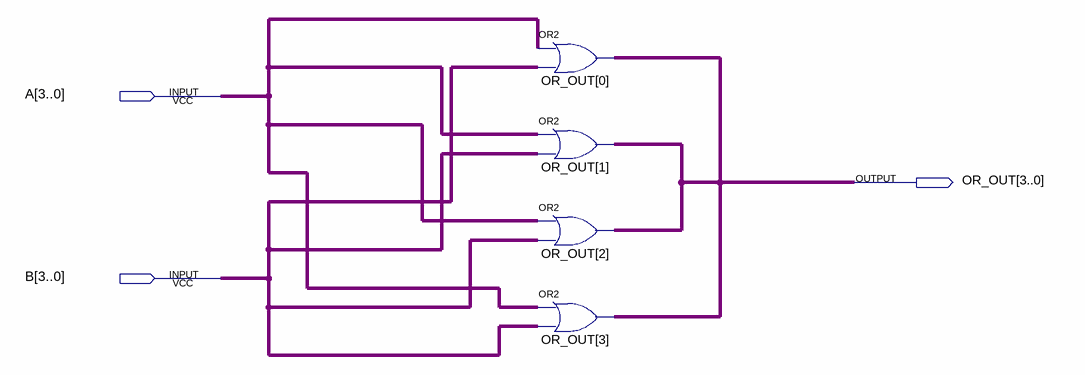
[diagram p0: schematic sheet]
// Quartus schematic or_unit.bdf as structural Verilog: 4 symbols, 3 pins
module or_unit (
  input  [3:0] A,
  input  [3:0] B,
  output [3:0] OR_OUT
);

  assign OR_OUT = A | B;  // OR2 OR_OUT[0], 4 bits wide
  assign OR_OUT = A | B;  // OR2 OR_OUT[1], 4 bits wide
  assign OR_OUT = A | B;  // OR2 OR_OUT[2], 4 bits wide
  assign OR_OUT = A | B;  // OR2 OR_OUT[3], 4 bits wide
endmodule
